# EAGLE schematic backplane (EAGLE 6.6.0)
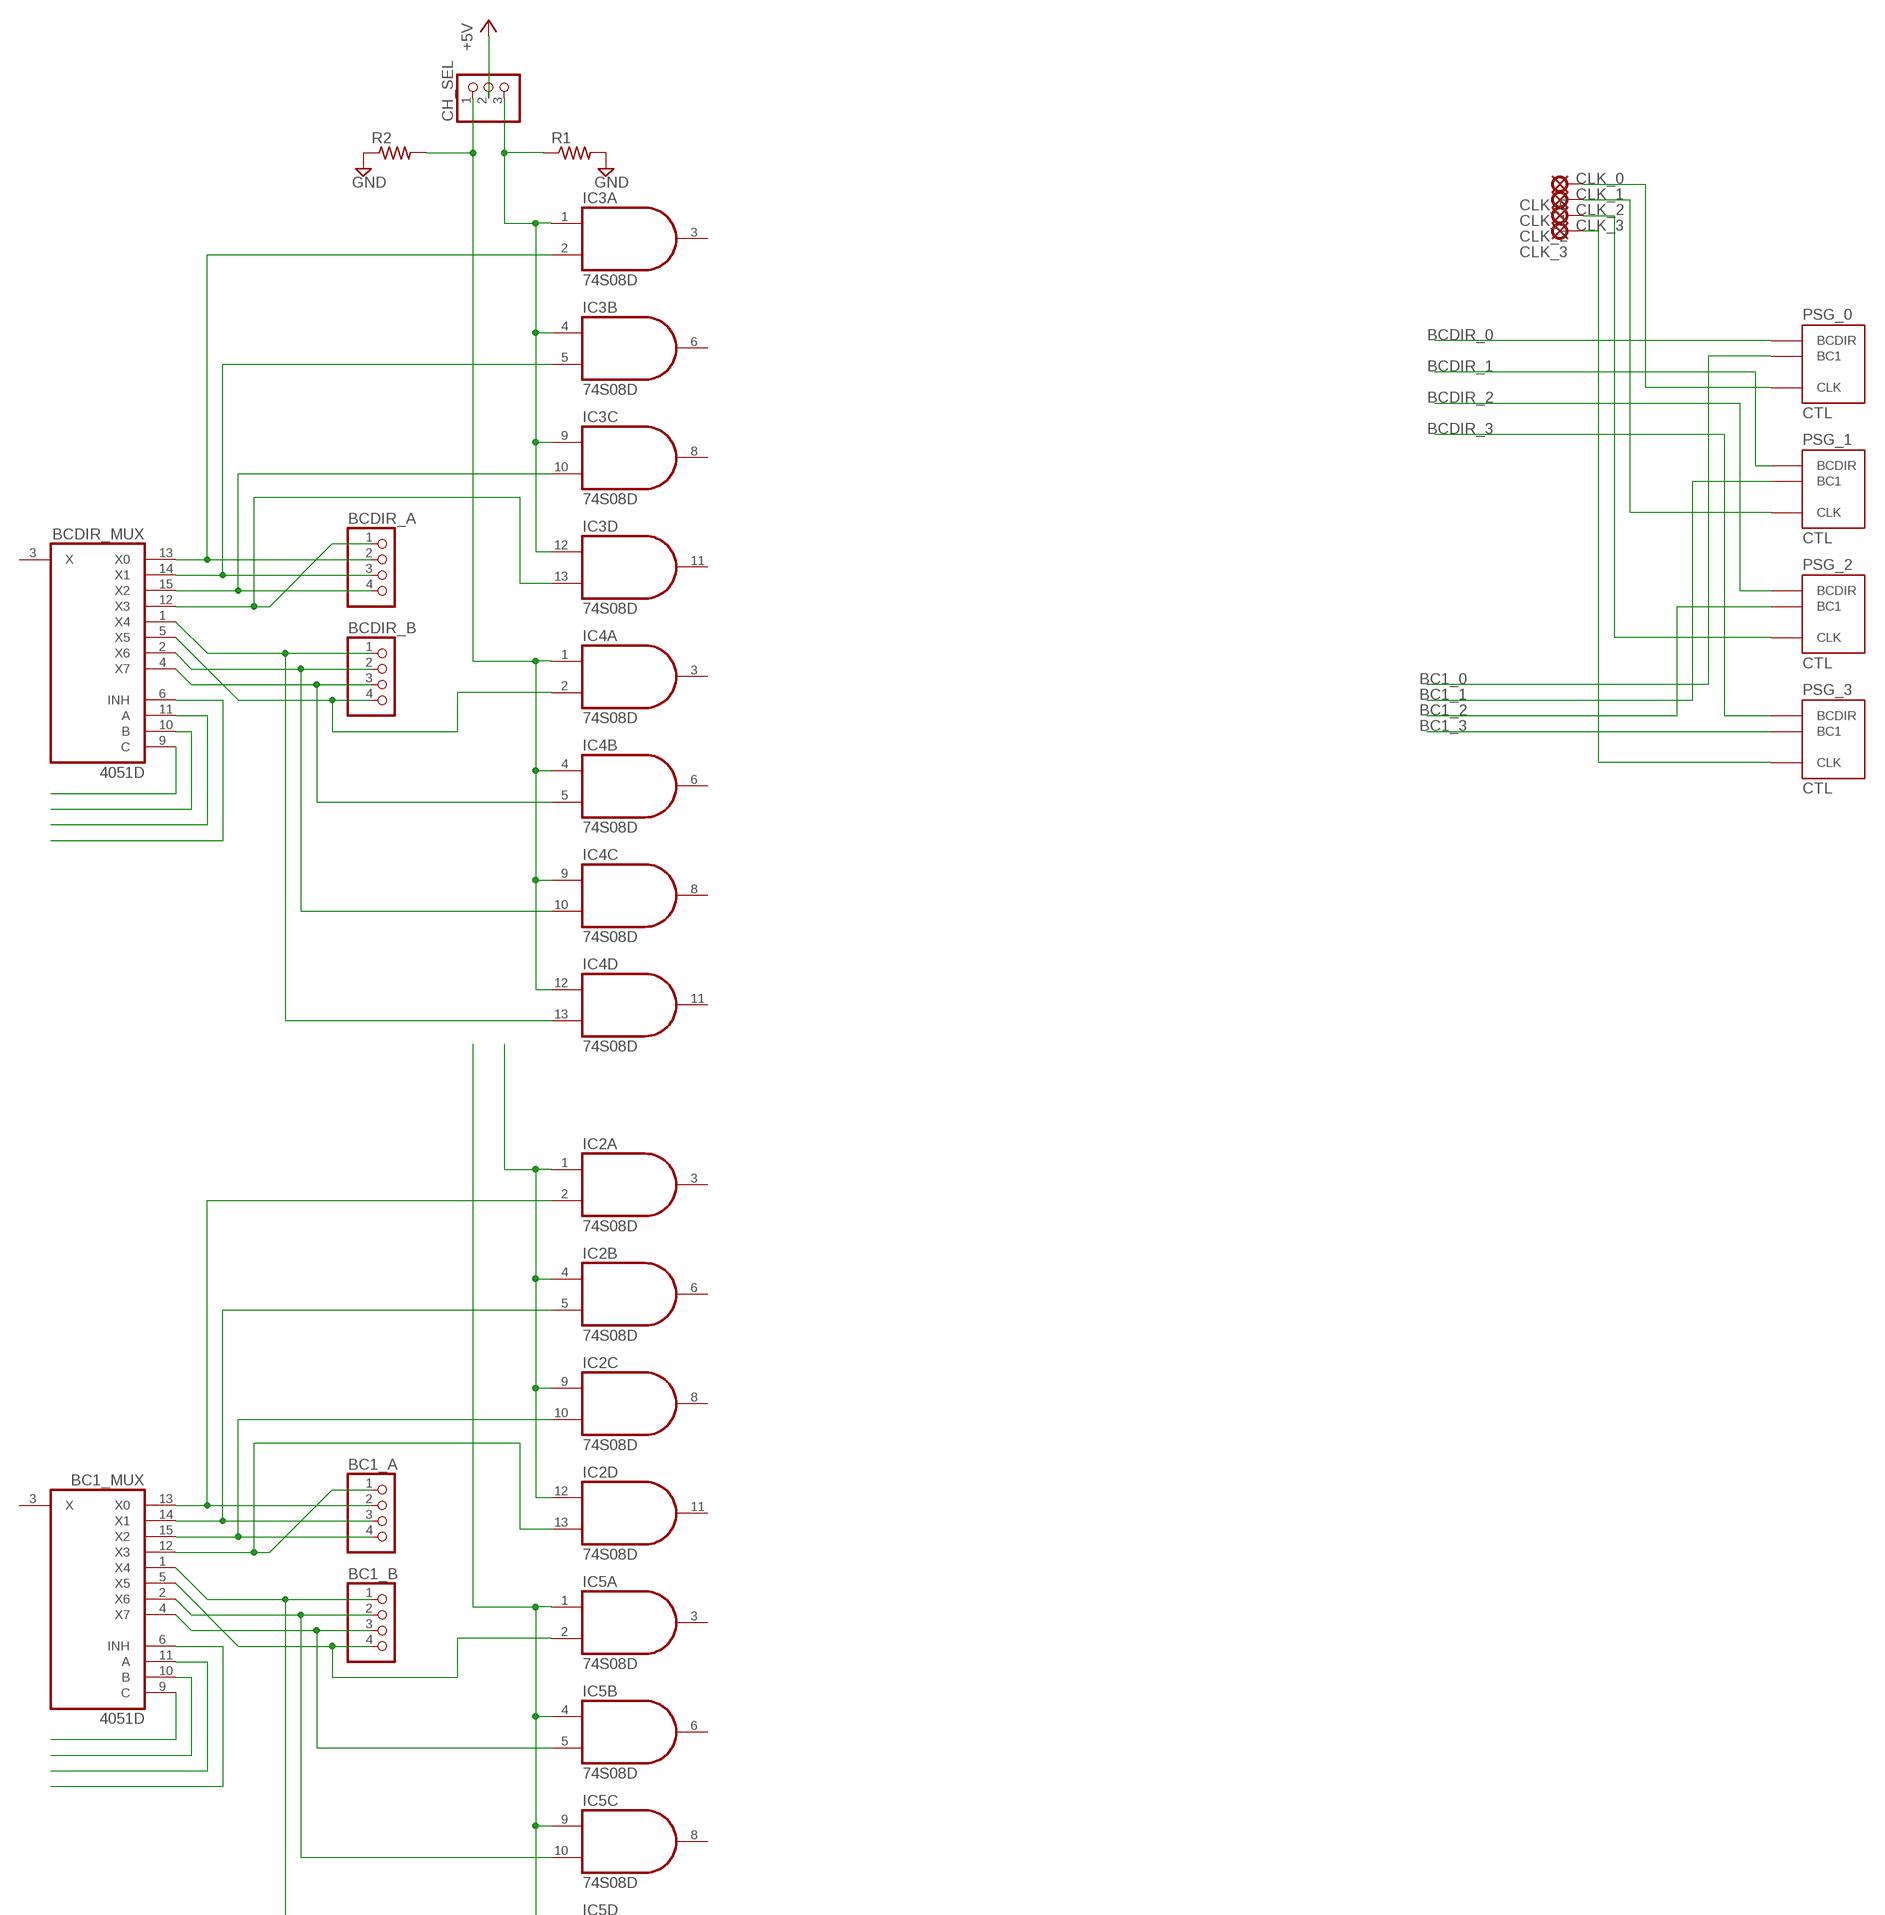
[diagram p0: schematic, sheet 1, part 1 of 3]
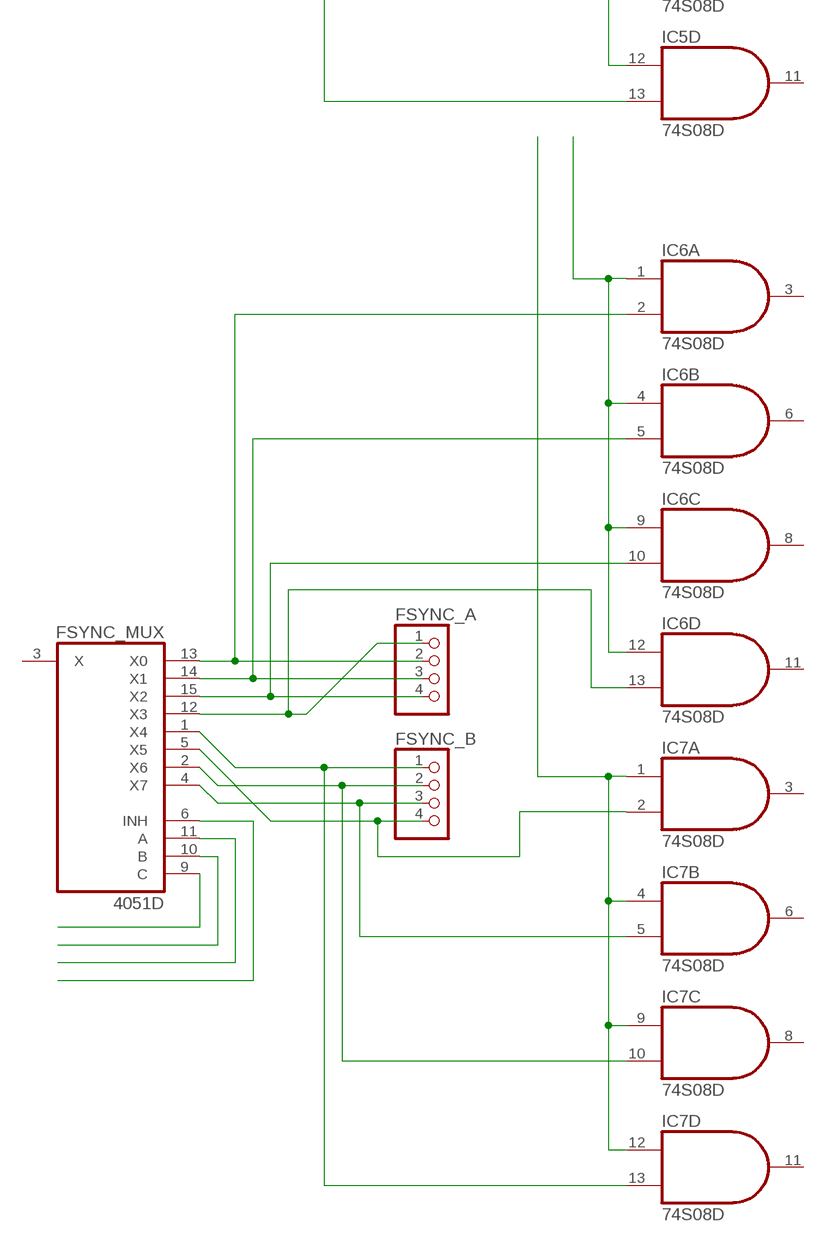
[diagram p1: schematic, sheet 1, part 2 of 3]
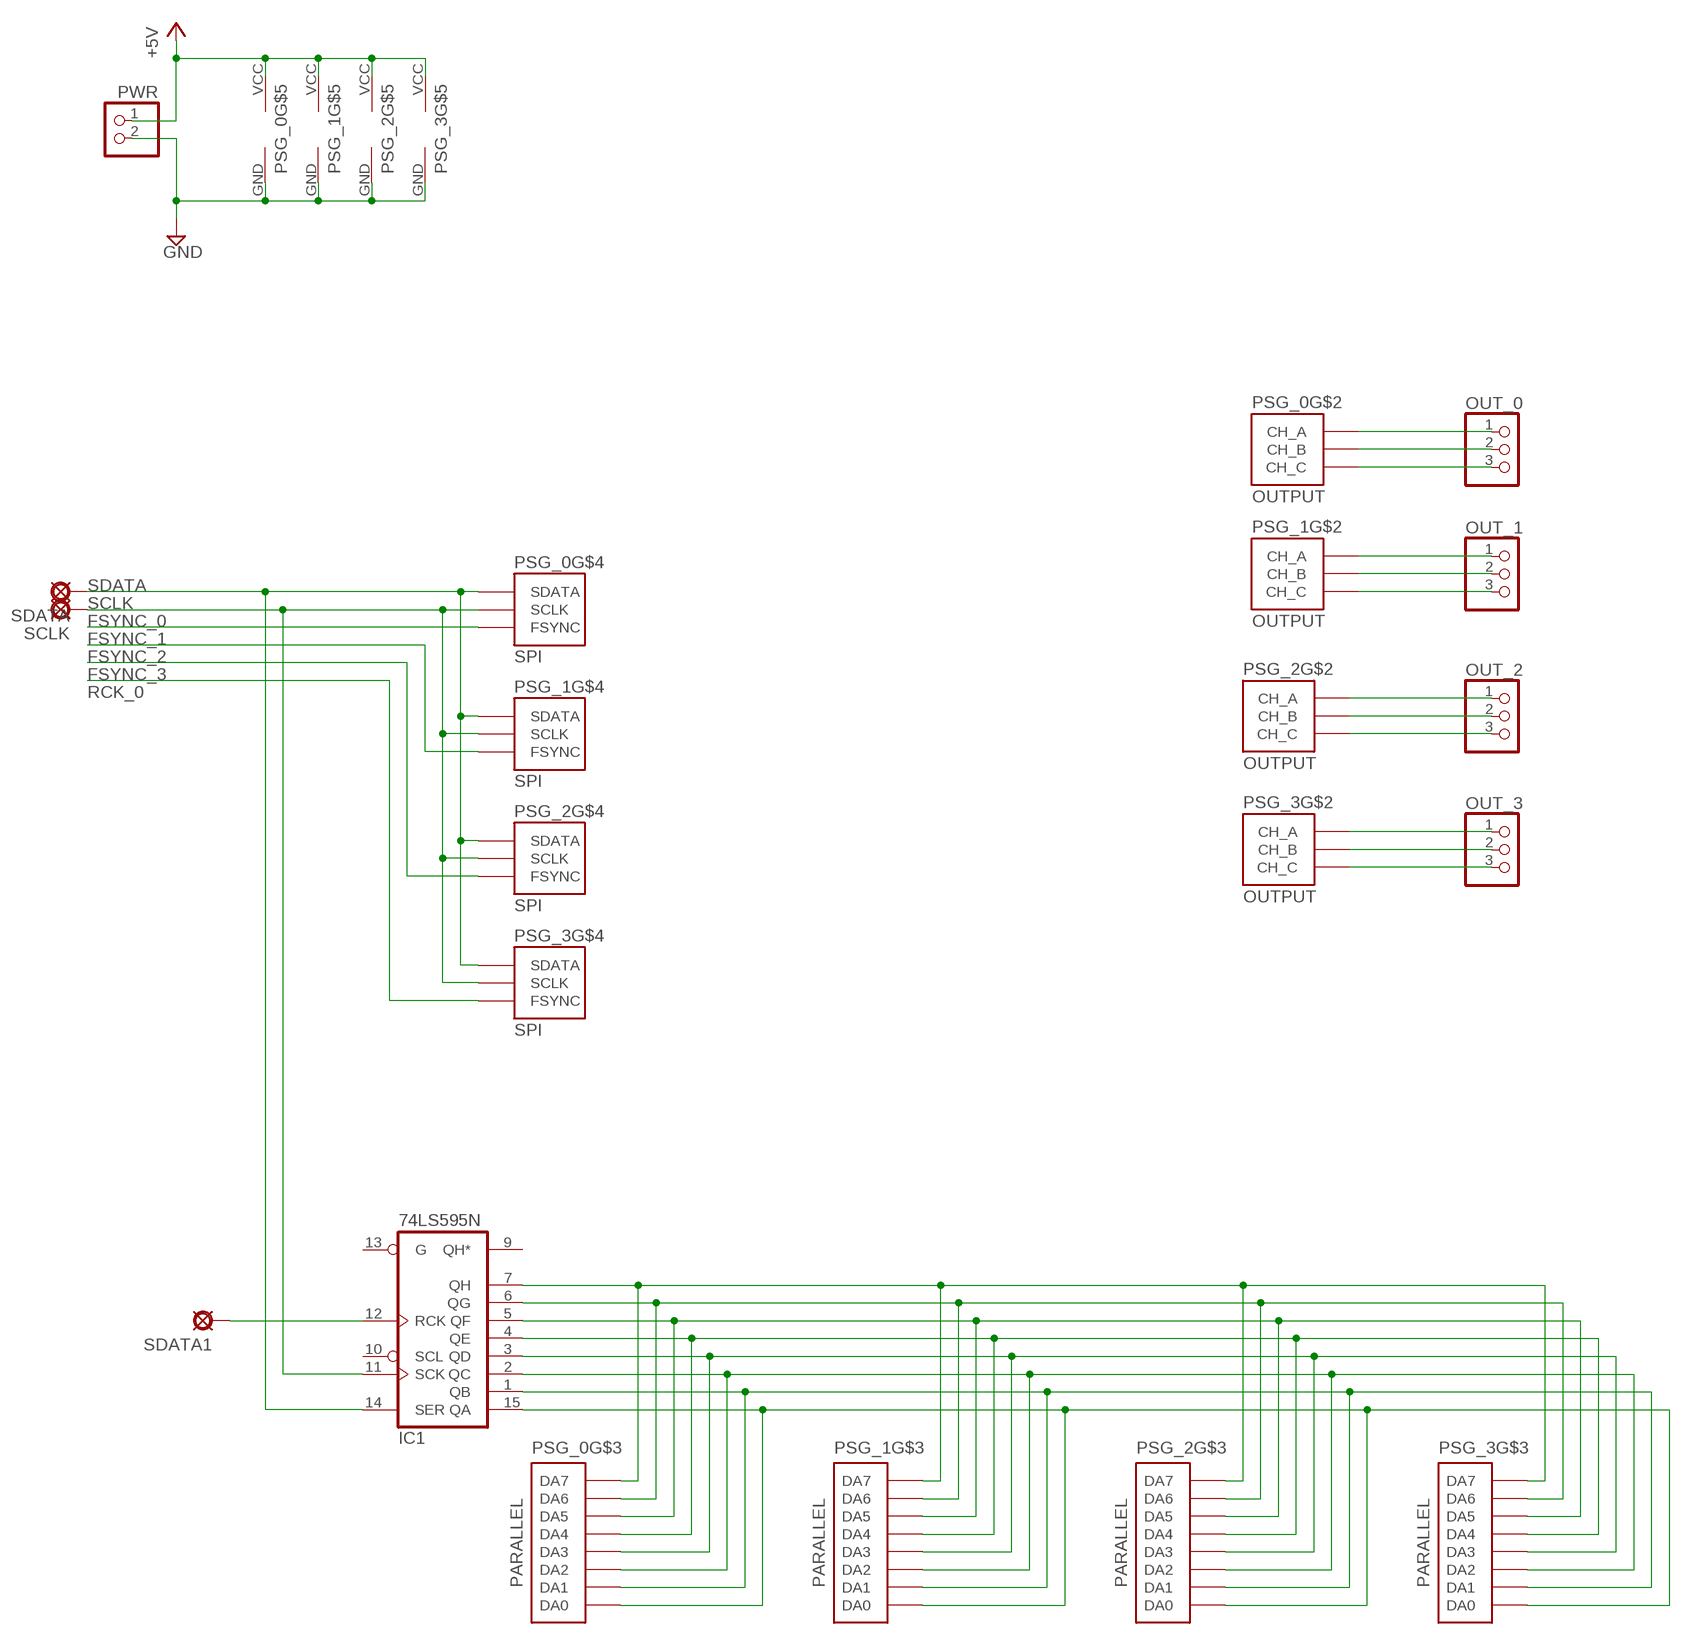
[diagram p2: schematic, sheet 1, part 3 of 3]

## Parts
BC1_A  PINHD-1X4  [1X04]
BC1_B  PINHD-1X4  [1X04]
BC1_MUX  4051D  [SO16]
BCDIR_A  PINHD-1X4  [1X04]
BCDIR_B  PINHD-1X4  [1X04]
BCDIR_MUX  4051D  [SO16]
CH_SEL  PINHD-1X3  [1X03]
CLK_0  PAD  [SQUARE]
CLK_1  PAD  [SQUARE]
CLK_2  PAD  [SQUARE]
CLK_3  PAD  [SQUARE]
FSYNC_A  PINHD-1X4  [1X04]
FSYNC_B  PINHD-1X4  [1X04]
FSYNC_MUX  4051D  [SO16]
IC1  74LS595N  [DIL16]
IC2  74S08D  [SO14]
IC3  74S08D  [SO14]
IC4  74S08D  [SO14]
IC5  74S08D  [SO14]
IC6  74S08D  [SO14]
IC7  74S08D  [SO14]
OUT_0  PINHD-1X3  [1X03]
OUT_1  PINHD-1X3  [1X03]
OUT_2  PINHD-1X3  [1X03]
OUT_3  PINHD-1X3  [1X03]
PSG_0  PSG_DAUGHTER  [PSG_DAUGHTER]
PSG_1  PSG_DAUGHTER  [PSG_DAUGHTER]
PSG_2  PSG_DAUGHTER  [PSG_DAUGHTER]
PSG_3  PSG_DAUGHTER  [PSG_DAUGHTER]
PWR  PINHD-1X2  [1X02]
R1  6MM.3  [R0207/3]
R2  6MM.3  [R0207/3]
SCLK  PAD  [SQUARE]
SDATA  PAD  [SQUARE]
SDATA1  PAD  [SQUARE]

## Nets
+5V: CH_SEL.2 PSG_0.VCC PSG_1.VCC PSG_2.VCC PSG_3.VCC PWR.1
BC1_0: PSG_0.BC1
BC1_1: PSG_1.BC1
BC1_2: PSG_2.BC1
BC1_3: PSG_3.BC1
BCDIR_0: PSG_0.BCDIR
BCDIR_1: PSG_1.BCDIR
BCDIR_2: PSG_2.BCDIR
BCDIR_3: PSG_3.BCDIR
CH_A: CH_SEL.3 IC2.1(A:I0) IC2.4(B:I0) IC2.9(C:I0) IC2.12(D:I0) IC3.1(A:I0) IC3.4(B:I0) IC3.9(C:I0) IC3.12(D:I0) IC6.1(A:I0) IC6.4(B:I0) IC6.9(C:I0) IC6.12(D:I0) R1.1
CH_B: CH_SEL.1 IC4.1(A:I0) IC4.4(B:I0) IC4.9(C:I0) IC4.12(D:I0) IC5.1(A:I0) IC5.4(B:I0) IC5.9(C:I0) IC5.12(D:I0) IC7.1(A:I0) IC7.4(B:I0) IC7.9(C:I0) IC7.12(D:I0) R2.2
CLK_0: CLK_0.1(PAD) PSG_0.CLK
CLK_1: CLK_1.1(PAD) PSG_1.CLK
CLK_2: CLK_2.1(PAD) PSG_2.CLK
CLK_3: CLK_3.1(PAD) PSG_3.CLK
FSYNC_0: PSG_0.FSYNC
FSYNC_1: PSG_1.FSYNC
FSYNC_2: PSG_2.FSYNC
FSYNC_3: PSG_3.FSYNC
GND: PSG_0.GND PSG_1.GND PSG_2.GND PSG_3.GND PWR.2 R1.2 R2.1
N$1: BCDIR_A.1 BCDIR_MUX.12(X3) IC3.13(D:I1)
N$2: BCDIR_A.2 BCDIR_MUX.13(X0) IC3.2(A:I1)
N$3: BCDIR_A.3 BCDIR_MUX.14(X1) IC3.5(B:I1)
N$4: BCDIR_A.4 BCDIR_MUX.15(X2) IC3.10(C:I1)
N$5: BCDIR_B.1 BCDIR_MUX.1(X4) IC4.13(D:I1)
N$6: BCDIR_B.2 BCDIR_MUX.2(X6) IC4.10(C:I1)
N$7: BCDIR_B.3 BCDIR_MUX.4(X7) IC4.5(B:I1)
N$8: BCDIR_B.4 BCDIR_MUX.5(X5) IC4.2(A:I1)
N$9: BCDIR_MUX.9(C)
N$10: BCDIR_MUX.10(B)
N$11: BCDIR_MUX.11(A)
N$12: BCDIR_MUX.6(INH)
N$15: BC1_A.1 BC1_MUX.12(X3) IC2.13(D:I1)
N$16: IC1.7(QH) PSG_0.DA7 PSG_1.DA7 PSG_2.DA7 PSG_3.DA7
N$17: IC1.15(QA) PSG_0.DA0 PSG_1.DA0 PSG_2.DA0 PSG_3.DA0
N$18: IC1.1(QB) PSG_0.DA1 PSG_1.DA1 PSG_2.DA1 PSG_3.DA1
N$19: IC1.2(QC) PSG_0.DA2 PSG_1.DA2 PSG_2.DA2 PSG_3.DA2
N$20: IC1.3(QD) PSG_0.DA3 PSG_1.DA3 PSG_2.DA3 PSG_3.DA3
N$21: IC1.4(QE) PSG_0.DA4 PSG_1.DA4 PSG_2.DA4 PSG_3.DA4
N$22: IC1.5(QF) PSG_0.DA5 PSG_1.DA5 PSG_2.DA5 PSG_3.DA5
N$23: IC1.6(QG) PSG_0.DA6 PSG_1.DA6 PSG_2.DA6 PSG_3.DA6
N$24: OUT_0.1 PSG_0.OUT_A(CH_A)
N$25: OUT_0.2 PSG_0.OUT_B(CH_B)
N$26: OUT_0.3 PSG_0.OUT_C(CH_C)
N$27: OUT_1.1 PSG_1.OUT_A(CH_A)
N$28: OUT_1.2 PSG_1.OUT_B(CH_B)
N$29: OUT_1.3 PSG_1.OUT_C(CH_C)
N$30: OUT_2.1 PSG_2.OUT_A(CH_A)
N$31: OUT_2.2 PSG_2.OUT_B(CH_B)
N$32: OUT_2.3 PSG_2.OUT_C(CH_C)
N$33: OUT_3.1 PSG_3.OUT_A(CH_A)
N$34: OUT_3.2 PSG_3.OUT_B(CH_B)
N$35: OUT_3.3 PSG_3.OUT_C(CH_C)
N$36: BC1_A.2 BC1_MUX.13(X0) IC2.2(A:I1)
N$37: BC1_A.3 BC1_MUX.14(X1) IC2.5(B:I1)
N$38: BC1_A.4 BC1_MUX.15(X2) IC2.10(C:I1)
N$39: BC1_B.1 BC1_MUX.1(X4) IC5.13(D:I1)
N$40: BC1_B.4 BC1_MUX.5(X5) IC5.2(A:I1)
N$41: BC1_B.2 BC1_MUX.2(X6) IC5.10(C:I1)
N$42: BC1_B.3 BC1_MUX.4(X7) IC5.5(B:I1)
N$43: BC1_MUX.9(C)
N$44: BC1_MUX.10(B)
N$45: BC1_MUX.11(A)
N$46: BC1_MUX.6(INH)
N$49: FSYNC_A.1 FSYNC_MUX.12(X3) IC6.13(D:I1)
N$50: FSYNC_A.2 FSYNC_MUX.13(X0) IC6.2(A:I1)
N$51: FSYNC_A.3 FSYNC_MUX.14(X1) IC6.5(B:I1)
N$52: FSYNC_A.4 FSYNC_MUX.15(X2) IC6.10(C:I1)
N$53: FSYNC_B.1 FSYNC_MUX.1(X4) IC7.13(D:I1)
N$54: FSYNC_B.4 FSYNC_MUX.5(X5) IC7.2(A:I1)
N$55: FSYNC_B.2 FSYNC_MUX.2(X6) IC7.10(C:I1)
N$56: FSYNC_B.3 FSYNC_MUX.4(X7) IC7.5(B:I1)
N$57: FSYNC_MUX.9(C)
N$58: FSYNC_MUX.10(B)
N$59: FSYNC_MUX.11(A)
N$60: FSYNC_MUX.6(INH)
RCK_0: IC1.12(RCK) SDATA1.1(PAD)
SCLK: IC1.11(SCK) PSG_0.SCLK PSG_1.SCLK PSG_2.SCLK PSG_3.SCLK SCLK.1(PAD)
SDATA: IC1.14(SER) PSG_0.SDATA PSG_1.SDATA PSG_2.SDATA PSG_3.SDATA SDATA.1(PAD)
Unconnected: BC1_MUX.3(X) BCDIR_MUX.3(X) FSYNC_MUX.3(X) IC1.9(QH*) IC1.10(SCL) IC1.13(G) IC2.3(A:O) IC2.6(B:O) IC2.8(C:O) IC2.11(D:O) IC3.3(A:O) IC3.6(B:O) IC3.8(C:O) IC3.11(D:O) IC4.3(A:O) IC4.6(B:O) IC4.8(C:O) IC4.11(D:O) IC5.3(A:O) IC5.6(B:O) IC5.8(C:O) IC5.11(D:O) IC6.3(A:O) IC6.6(B:O) IC6.8(C:O) IC6.11(D:O) IC7.3(A:O) IC7.6(B:O) IC7.8(C:O) IC7.11(D:O)

## Power pins joined to a net without a drawn wire
GND: BC1_MUX.8(GND) BCDIR_MUX.8(GND) FSYNC_MUX.8(GND) IC1.8(GND) IC2.7(P:GND) IC3.7(P:GND) IC4.7(P:GND) IC5.7(P:GND) IC6.7(P:GND) IC7.7(P:GND)
VCC: BC1_MUX.16(VCC) BCDIR_MUX.16(VCC) FSYNC_MUX.16(VCC) IC1.16(VCC) IC2.14(P:VCC) IC3.14(P:VCC) IC4.14(P:VCC) IC5.14(P:VCC) IC6.14(P:VCC) IC7.14(P:VCC)
VEE: BC1_MUX.7(VEE) BCDIR_MUX.7(VEE) FSYNC_MUX.7(VEE)

## Library data of the parts
BC1_A BC1_B BCDIR_A BCDIR_B FSYNC_A FSYNC_B = pinhead:PINHD-1X4: PIN HEADER
BC1_MUX BCDIR_MUX FSYNC_MUX = 40xx:4051: 8-channel ANALOG MULTIPLEXER
CH_SEL OUT_0 OUT_1-OUT_3 = pinhead:PINHD-1X3: PIN HEADER
CLK_0 CLK_1-CLK_3 SCLK SDATA SDATA1 = gm-supply:PAD: PAD use this package for pads with any purpose, including input, output, send or return various pad shapes: round, square, octogonal, long, and long offset
IC1 = 74xx-us:74*595: 8-bit SHIFT REGISTER, output latch
IC2-IC7 = 74xx-us:74*08: Quad 2-input AND gate
PSG_0 PSG_1-PSG_3 = jaapie:PSG_DAUGHTER
PWR = pinhead:PINHD-1X2: PIN HEADER
R1 R2 = gm-resistors:6MM: 6mm Resistors Leads spaced 1-6 holes apart for 0.1" perfboard. Suitable for 1/4 watt resistors.